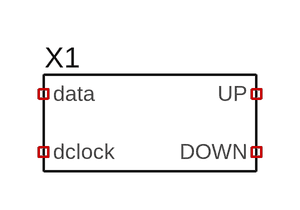
[diagram p0: schematic Draft1.asc]
Draft1.asc, the LTspice schematic file:
Version 4
SHEET 1 880 680
SYMBOL pfd2 128 176 R0
SYMATTR InstName X1

The netlist it stands for:
* Draft1.asc
XX1 NC_01 NC_02 NC_03 NC_04 pfd2 VDD=1.8 L=0.18u LD=0.48u WN=0.42u WPFACT=1.5  ; pins data dclock UP DOWN
.backanno
.end